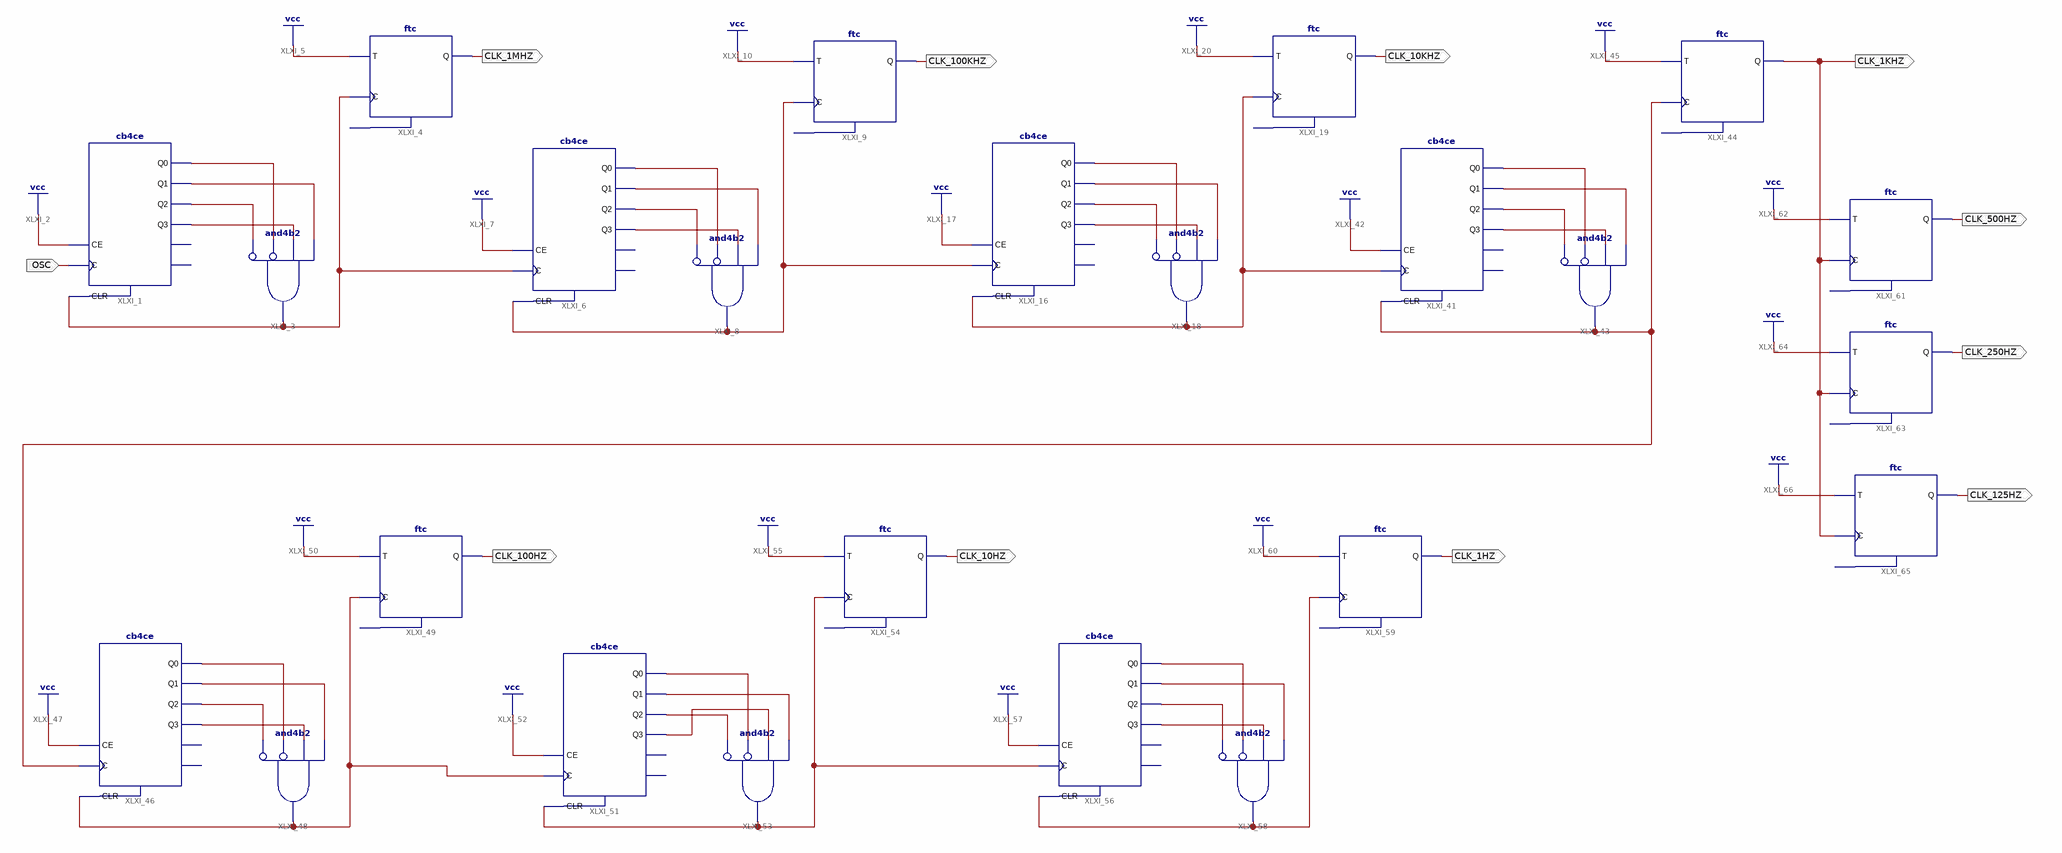
[diagram p0: schematic sheet 1]
// Xilinx ISE schematic Clock_Hz.sch (spartan6) as structural Verilog: 24 symbols, 11 ports
module Clock_Hz (
  input  OSC,
  output CLK_1MHZ,
  output CLK_100KHZ,
  output CLK_10KHZ,
  output CLK_1KHZ,
  output CLK_100HZ,
  output CLK_10HZ,
  output CLK_1HZ,
  output CLK_500HZ,
  output CLK_250HZ,
  output CLK_125HZ
);

  wire XLXN_3, XLXN_4, XLXN_5, XLXN_6, XLXN_8, XLXN_13, XLXN_14, XLXN_15, XLXN_16, XLXN_18, XLXN_33, XLXN_34,
       XLXN_35, XLXN_36, XLXN_38, XLXN_81, XLXN_82, XLXN_83, XLXN_84, XLXN_86, XLXN_91, XLXN_92, XLXN_93,
       XLXN_94, XLXN_96, XLXN_101, XLXN_102, XLXN_103, XLXN_104, XLXN_106, XLXN_111, XLXN_112, XLXN_113,
       XLXN_114, XLXN_116;

  cb4ce XLXI_1 (.C(OSC), .CE(1'b1), .CLR(XLXN_8), .Q0(XLXN_5), .Q1(XLXN_4), .Q2(XLXN_6), .Q3(XLXN_3));  // open: CEO, TC
  and XLXI_3 (XLXN_8, ~XLXN_6, ~XLXN_5, XLXN_3, XLXN_4);  // and4b2
  ftc XLXI_4 (.C(XLXN_8), .T(1'b1), .Q(CLK_1MHZ));  // open: CLR
  cb4ce XLXI_6 (
    .C(XLXN_8), .CE(1'b1), .CLR(XLXN_18), .Q0(XLXN_15), .Q1(XLXN_14), .Q2(XLXN_16), .Q3(XLXN_13));  // open: CEO, TC
  and XLXI_8 (XLXN_18, ~XLXN_16, ~XLXN_15, XLXN_13, XLXN_14);  // and4b2
  ftc XLXI_9 (.C(XLXN_18), .T(1'b1), .Q(CLK_100KHZ));  // open: CLR
  cb4ce XLXI_16 (
    .C(XLXN_18), .CE(1'b1), .CLR(XLXN_38), .Q0(XLXN_35), .Q1(XLXN_34), .Q2(XLXN_36), .Q3(XLXN_33));  // open: CEO, TC
  and XLXI_18 (XLXN_38, ~XLXN_36, ~XLXN_35, XLXN_33, XLXN_34);  // and4b2
  ftc XLXI_19 (.C(XLXN_38), .T(1'b1), .Q(CLK_10KHZ));  // open: CLR
  cb4ce XLXI_41 (
    .C(XLXN_38), .CE(1'b1), .CLR(XLXN_86), .Q0(XLXN_83), .Q1(XLXN_82), .Q2(XLXN_84), .Q3(XLXN_81));  // open: CEO, TC
  and XLXI_43 (XLXN_86, ~XLXN_84, ~XLXN_83, XLXN_81, XLXN_82);  // and4b2
  ftc XLXI_44 (.C(XLXN_86), .T(1'b1), .Q(CLK_1KHZ));  // open: CLR
  cb4ce XLXI_46 (
    .C(XLXN_86), .CE(1'b1), .CLR(XLXN_96), .Q0(XLXN_93), .Q1(XLXN_92), .Q2(XLXN_94), .Q3(XLXN_91));  // open: CEO, TC
  and XLXI_48 (XLXN_96, ~XLXN_94, ~XLXN_93, XLXN_91, XLXN_92);  // and4b2
  ftc XLXI_49 (.C(XLXN_96), .T(1'b1), .Q(CLK_100HZ));  // open: CLR
  cb4ce XLXI_51 (
    .C(XLXN_96), .CE(1'b1), .CLR(XLXN_106), .Q0(XLXN_103), .Q1(XLXN_102), .Q2(XLXN_104), .Q3(XLXN_101));  // open: CEO, TC
  and XLXI_53 (XLXN_106, ~XLXN_104, ~XLXN_103, XLXN_101, XLXN_102);  // and4b2
  ftc XLXI_54 (.C(XLXN_106), .T(1'b1), .Q(CLK_10HZ));  // open: CLR
  cb4ce XLXI_56 (
    .C(XLXN_106), .CE(1'b1), .CLR(XLXN_116), .Q0(XLXN_113), .Q1(XLXN_112), .Q2(XLXN_114), .Q3(XLXN_111));  // open: CEO, TC
  and XLXI_58 (XLXN_116, ~XLXN_114, ~XLXN_113, XLXN_111, XLXN_112);  // and4b2
  ftc XLXI_59 (.C(XLXN_116), .T(1'b1), .Q(CLK_1HZ));  // open: CLR
  ftc XLXI_61 (.C(CLK_1KHZ), .T(1'b1), .Q(CLK_500HZ));  // open: CLR
  ftc XLXI_63 (.C(CLK_1KHZ), .T(1'b1), .Q(CLK_250HZ));  // open: CLR
  ftc XLXI_65 (.C(CLK_1KHZ), .T(1'b1), .Q(CLK_125HZ));  // open: CLR
endmodule
